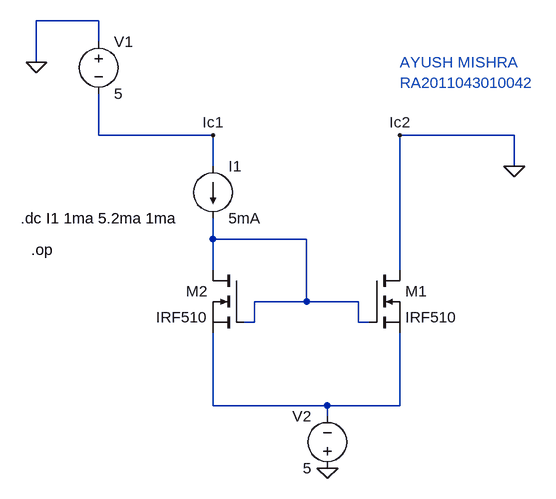
[diagram p0: schematic exp_10.asc]
exp_10.asc, the LTspice schematic file:
Version 4
SHEET 1 880 704
WIRE -64 -32 -160 -32
WIRE -64 0 -64 -32
WIRE -160 32 -160 -32
WIRE -64 144 -64 80
WIRE 112 144 -64 144
WIRE 576 144 400 144
WIRE 112 192 112 144
WIRE 576 192 576 144
WIRE 112 304 112 272
WIRE 256 304 112 304
WIRE 112 352 112 304
WIRE 400 352 400 144
WIRE 256 400 256 304
WIRE 256 400 176 400
WIRE 336 400 256 400
WIRE 176 432 176 400
WIRE 176 432 160 432
WIRE 336 432 336 400
WIRE 352 432 336 432
WIRE 112 560 112 448
WIRE 288 560 112 560
WIRE 400 560 400 448
WIRE 400 560 288 560
WIRE 288 576 288 560
FLAG -160 32 0
FLAG 576 192 0
FLAG 288 656 0
FLAG 400 144 Ic2
FLAG 112 144 Ic1
SYMBOL current 112 192 R0
WINDOW 123 0 0 Left 0
WINDOW 39 0 0 Left 0
SYMATTR InstName I1
SYMATTR Value 5mA
SYMBOL voltage -64 -16 R0
WINDOW 123 0 0 Left 0
WINDOW 39 0 0 Left 0
SYMATTR InstName V1
SYMATTR Value 5
SYMBOL voltage 288 672 R180
WINDOW 0 24 96 Left 2
WINDOW 3 24 16 Left 2
WINDOW 123 0 0 Left 0
WINDOW 39 0 0 Left 0
SYMATTR InstName V2
SYMATTR Value 5
SYMBOL nmos 352 352 R0
SYMATTR InstName M1
SYMATTR Value IRF510
SYMBOL nmos 160 352 M0
SYMATTR InstName M2
SYMATTR Value IRF510
TEXT -184 272 Left 2 !.dc I1 1ma 5.2ma 1ma
TEXT -168 320 Left 2 !.op
TEXT 400 32 Left 2 ;AYUSH MISHRA\nRA2011043010042

The netlist it stands for:
* exp_10.asc
I1 Ic1 N001 5mA
V1 0 Ic1 5
V2 0 N002 5
M1 0 N001 N002 N002 IRF510
M2 N001 N001 N002 N002 IRF510
.model NMOS NMOS
.model PMOS PMOS
.lib standard.mos
.dc I1 1ma 5.2ma 1ma
.op
* AYUSH MISHRA
* RA2011043010042
.backanno
.end